# Altium schematic sheet RelayBoard.SchDoc
size A3
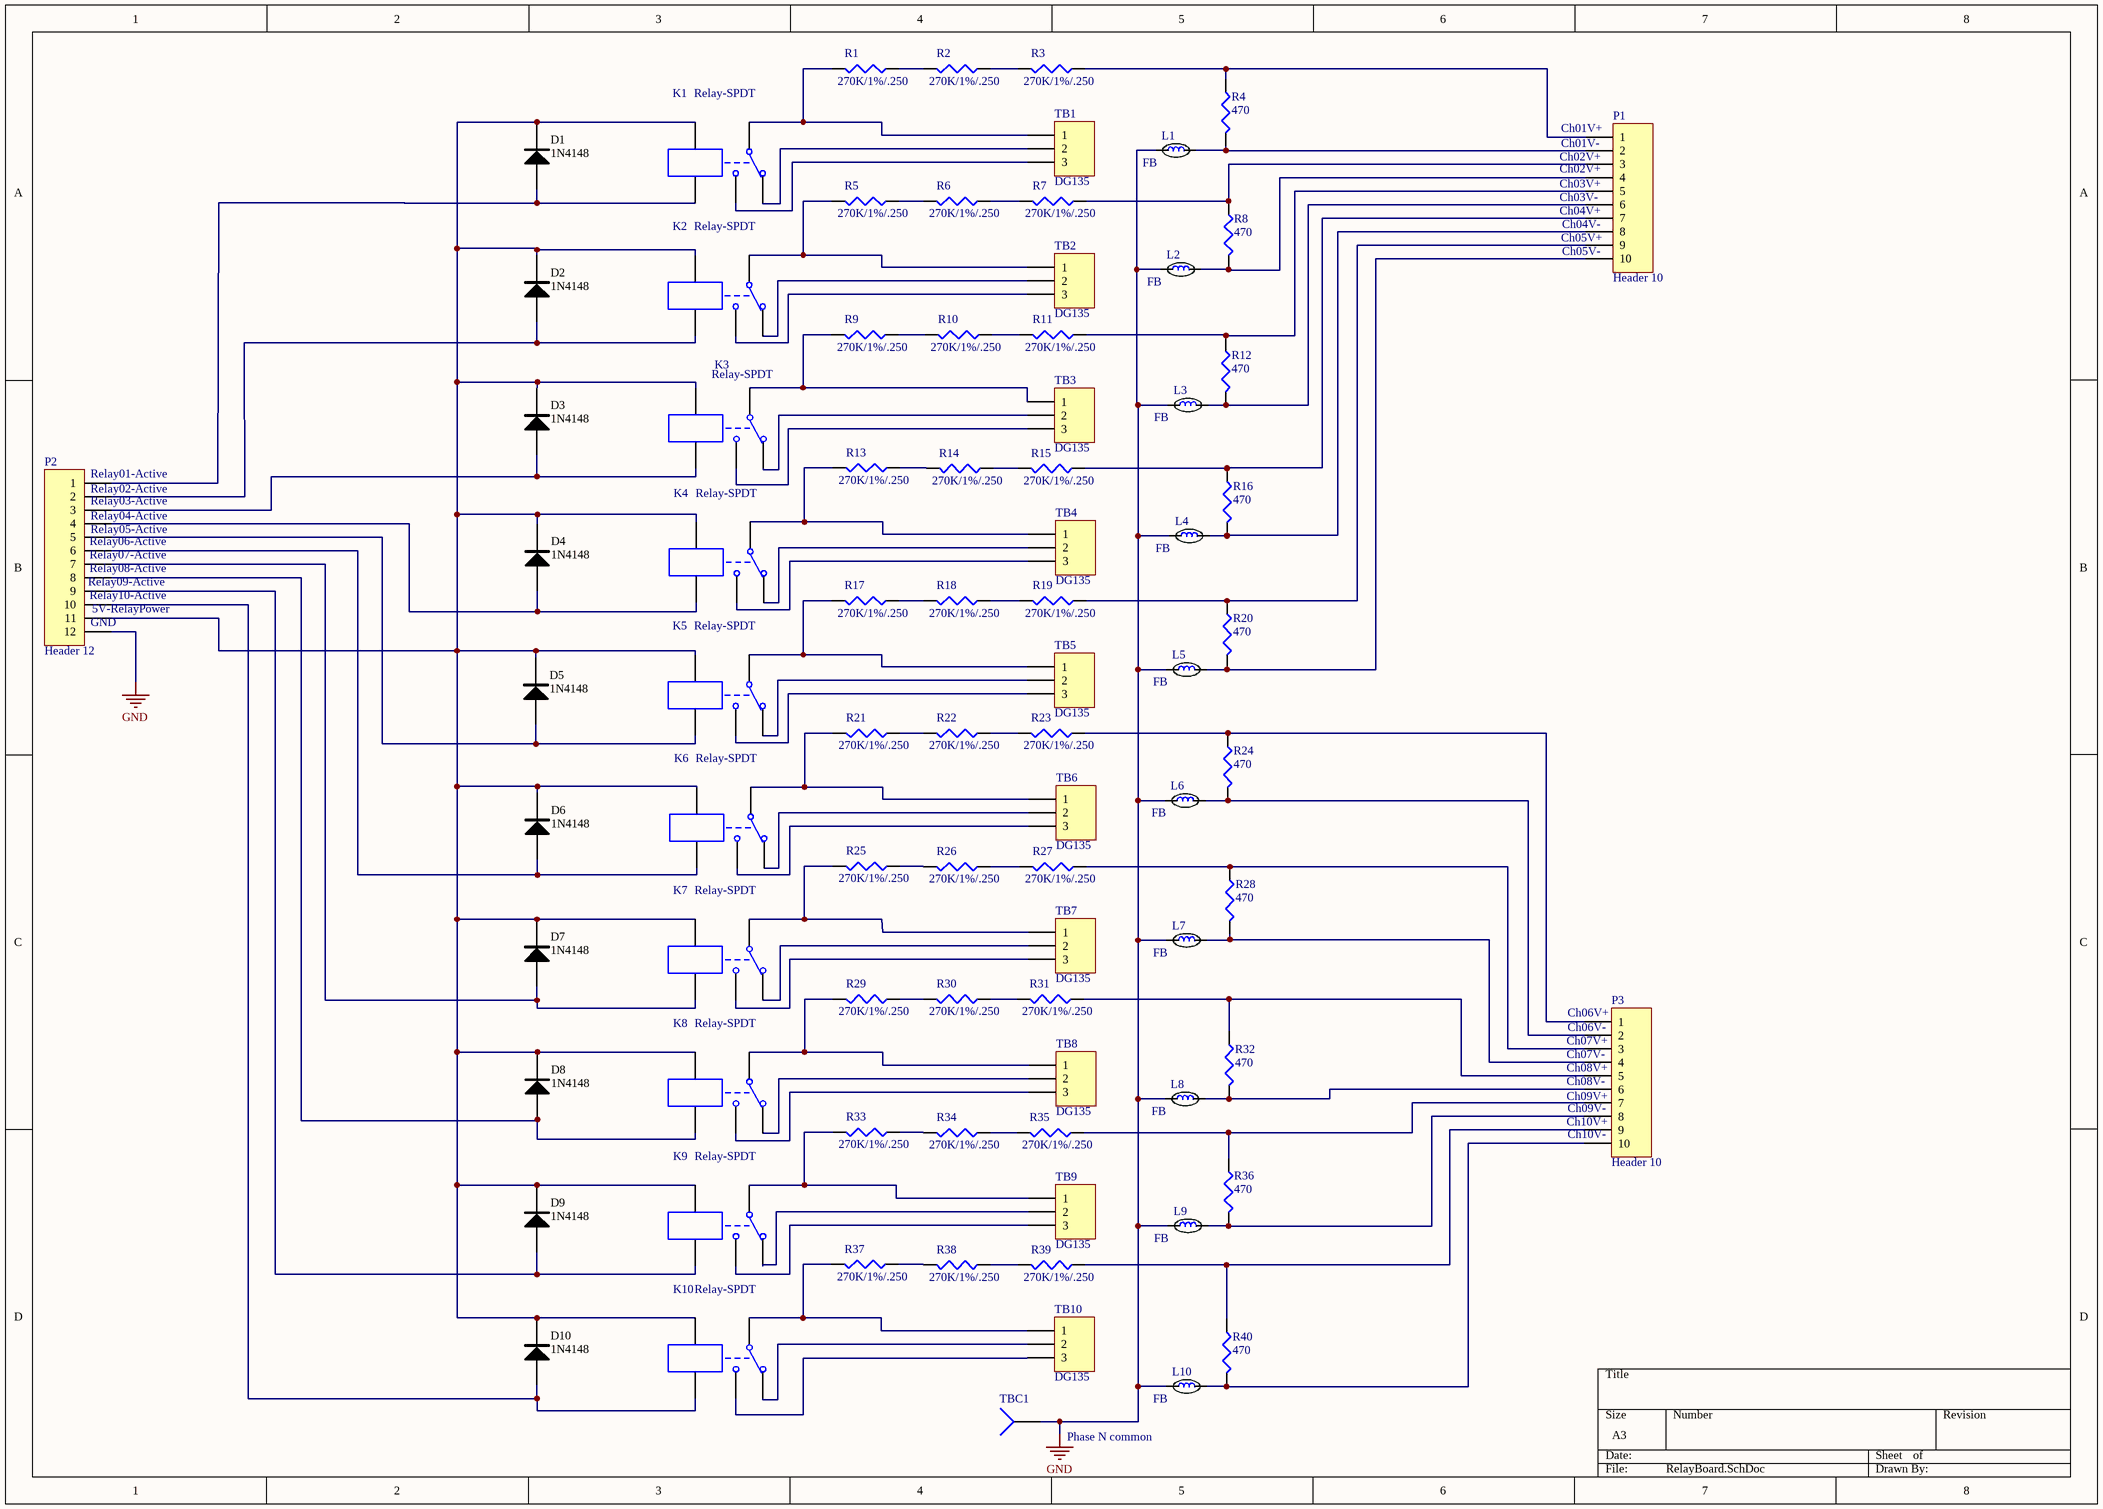
[diagram p0: RelayBoard.SchDoc]

## Parts
D1  1N4148  [SOD523]
D2  1N4148  [SOD523]
D3  1N4148  [SOD523]
D4  1N4148  [SOD523]
D5  1N4148  [SOD523]
D6  1N4148  [SOD523]
D7  1N4148  [SOD523]
D8  1N4148  [SOD523]
D9  1N4148  [SOD523]
D10  1N4148  [SOD523]
K1  Relay-SPDT  [MODULE5B]
K2  Relay-SPDT  [MODULE5B]
K3  Relay-SPDT  [MODULE5B]
K4  Relay-SPDT  [MODULE5B]
K5  Relay-SPDT  [MODULE5B]
K6  Relay-SPDT  [MODULE5B]
K7  Relay-SPDT  [MODULE5B]
K8  Relay-SPDT  [MODULE5B]
K9  Relay-SPDT  [MODULE5B]
K10  Relay-SPDT  [MODULE5B]
L1  FB  [0603C-TBD]
L2  FB  [0603C-TBD]
L3  FB  [0603C-TBD]
L4  FB  [0603C-TBD]
L5  FB  [0603C-TBD]
L6  FB  [0603C-TBD]
L7  FB  [0603C-TBD]
L8  FB  [0603C-TBD]
L9  FB  [0603C-TBD]
L10  FB  [0603C-TBD]
P1  Header 10  [HDR1X10]
P2  Header 12  [HDR1X12]
P3  Header 10  [HDR1X10]
R1  270K/1%/.250  [1210C-GENERIC]
R2  270K/1%/.250  [1210C-GENERIC]
R3  270K/1%/.250  [1210C-GENERIC]
R4  470  [1206C-GENERIC]
R5  270K/1%/.250  [1210C-GENERIC]
R6  270K/1%/.250  [1210C-GENERIC]
R7  270K/1%/.250  [1210C-GENERIC]
R8  470  [1206C-GENERIC]
R9  270K/1%/.250  [1210C-GENERIC]
R10  270K/1%/.250  [1210C-GENERIC]
R11  270K/1%/.250  [1210C-GENERIC]
R12  470  [1206C-GENERIC]
R13  270K/1%/.250  [1210C-GENERIC]
R14  270K/1%/.250  [1210C-GENERIC]
R15  270K/1%/.250  [1210C-GENERIC]
R16  470  [1206C-GENERIC]
R17  270K/1%/.250  [1210C-GENERIC]
R18  270K/1%/.250  [1210C-GENERIC]
R19  270K/1%/.250  [1210C-GENERIC]
R20  470  [1206C-GENERIC]
R21  270K/1%/.250  [1210C-GENERIC]
R22  270K/1%/.250  [1210C-GENERIC]
R23  270K/1%/.250  [1210C-GENERIC]
R24  470  [1206C-GENERIC]
R25  270K/1%/.250  [1210C-GENERIC]
R26  270K/1%/.250  [1210C-GENERIC]
R27  270K/1%/.250  [1210C-GENERIC]
R28  470  [1206C-GENERIC]
R29  270K/1%/.250  [1210C-GENERIC]
R30  270K/1%/.250  [1210C-GENERIC]
R31  270K/1%/.250  [1210C-GENERIC]
R32  470  [1206C-GENERIC]
R33  270K/1%/.250  [1210C-GENERIC]
R34  270K/1%/.250  [1210C-GENERIC]
R35  270K/1%/.250  [1210C-GENERIC]
R36  470  [1206C-GENERIC]
R37  270K/1%/.250  [1210C-GENERIC]
R38  270K/1%/.250  [1210C-GENERIC]
R39  270K/1%/.250  [1210C-GENERIC]
R40  470  [1206C-GENERIC]
TB1  DG135  [DG135-1]
TB2  DG135  [DG135-1]
TB3  DG135  [DG135-1]
TB4  DG135  [DG135-1]
TB5  DG135  [DG135-1]
TB6  DG135  [DG135-1]
TB7  DG135  [DG135-1]
TB8  DG135  [DG135-1]
TB9  DG135  [DG135-1]
TB10  DG135  [DG135-1]
TBC1  TBcommon  [PIN1]  (value not drawn)

## Nets
GND: L1.1 L2.1 L3.1 L4.1 L5.1 L6.1 L7.1 L8.1 L9.1 L10.1 P2.12 TBC1.1
NetD1_A: D1.A K1.2 P2.1
NetD1_K: D1.K D2.K D3.K D4.K D5.K D6.K D7.K D8.K D9.K D10.K K1.1 K2.1 K3.1 K4.1 K5.1 K6.1 K7.1 K8.1 K9.1 K10.1 P2.11
NetD2_A: D2.A K2.2 P2.2
NetD3_A: D3.A K3.2 P2.3
NetD4_A: D4.A K4.2 P2.4
NetD5_A: D5.A K5.2 P2.5
NetD6_A: D6.A K6.2 P2.6
NetD7_A: D7.A K7.2 P2.7
NetD8_A: D8.A K8.2 P2.8
NetD9_A: D9.A K9.2 P2.9
NetD10_A: D10.A K10.2 P2.10
NetK1_3: K1.3 TB1.3
NetK1_4: K1.4 R1.2 TB1.1
NetK1_5: K1.5 TB1.2
NetK2_3: K2.3 TB2.3
NetK2_4: K2.4 R5.2 TB2.1
NetK2_5: K2.5 TB2.2
NetK3_3: K3.3 TB3.3
NetK3_4: K3.4 R9.2 TB3.1
NetK3_5: K3.5 TB3.2
NetK4_3: K4.3 TB4.3
NetK4_4: K4.4 R13.2 TB4.1
NetK4_5: K4.5 TB4.2
NetK5_3: K5.3 TB5.3
NetK5_4: K5.4 R17.2 TB5.1
NetK5_5: K5.5 TB5.2
NetK6_3: K6.3 TB6.3
NetK6_4: K6.4 R21.2 TB6.1
NetK6_5: K6.5 TB6.2
NetK7_3: K7.3 TB7.3
NetK7_4: K7.4 R25.2 TB7.1
NetK7_5: K7.5 TB7.2
NetK8_3: K8.3 TB8.3
NetK8_4: K8.4 R29.2 TB8.1
NetK8_5: K8.5 TB8.2
NetK9_3: K9.3 TB9.3
NetK9_4: K9.4 R33.2 TB9.1
NetK9_5: K9.5 TB9.2
NetK10_3: K10.3 TB10.3
NetK10_4: K10.4 R37.2 TB10.1
NetK10_5: K10.5 TB10.2
NetL1_2: L1.2 P1.2 R4.2
NetL2_2: L2.2 P1.4
NetL3_2: L3.2 P1.6 R12.2
NetL4_2: L4.2 P1.8 R16.2
NetL5_2: L5.2 P1.10
NetL6_2: L6.2 P3.2 R24.2
NetL7_2: L7.2 P3.4 R28.2
NetL8_2: L8.2 P3.6 R32.2
NetL9_2: L9.2 P3.8 R36.2
NetL10_2: L10.2 P3.10 R40.2
NetP1_1: P1.1 R3.1 R4.1
NetP1_3: P1.3 R7.1 R8.1
NetP1_5: P1.5 R11.1 R12.1
NetP1_7: P1.7 R15.1 R16.1
NetP1_9: P1.9 R19.1 R20.1
NetP3_1: P3.1 R23.1 R24.1
NetP3_3: P3.3 R27.1 R28.1
NetP3_5: P3.5 R31.1 R32.1
NetP3_7: P3.7 R35.1 R36.1
NetP3_9: P3.9 R39.1 R40.1
NetR1_1: R1.1 R2.2
NetR2_1: R2.1 R3.2
NetR5_1: R5.1 R6.2
NetR6_1: R6.1 R7.2
NetR9_1: R9.1 R10.2
NetR10_1: R10.1 R11.2
NetR13_1: R13.1 R14.2
NetR14_1: R14.1 R15.2
NetR17_1: R17.1 R18.2
NetR18_1: R18.1 R19.2
NetR21_1: R21.1 R22.2
NetR22_1: R22.1 R23.2
NetR25_1: R25.1 R26.2
NetR26_1: R26.1 R27.2
NetR29_1: R29.1 R30.2
NetR30_1: R30.1 R31.2
NetR33_1: R33.1 R34.2
NetR34_1: R34.1 R35.2
NetR37_1: R37.1 R38.2
NetR38_1: R38.1 R39.2

Not connected (* = marked no-connect by the designer): R8 2; R20 2

## Notes on the sheet
- (near P1) Ch02V+
- (near P1) Ch01V+
- (near P1) Ch01V-
- (near P1) Ch03V+
- (near P1) Ch03V-
- (near P1) Ch04V+
- (near P1) Ch05V+
- (near P1) Ch04V-
- (near P1) Ch05V-
- (near P2) Relay03-Active
- (near P2) Relay02-Active
- (near P2) Relay01-Active
- (near P2) Relay04-Active
- (near P2) Relay09-Active
- (near P2) Relay06-Active
- (near P2) Relay07-Active
- (near P2) Relay08-Active
- (near P2) Relay05-Active
- (near P2) Relay10-Active
- (near P2) GND
- (near P2) 5V-RelayPower
- (near P3) Ch07V+
- (near P3) Ch07V-
- (near P3) Ch06V+
- (near P3) Ch06V-
- (near P3) Ch08V+
- (near P3) Ch08V-
- (near P3) Ch09V+
- (near P3) Ch10V+
- (near P3) Ch09V-
- (near P3) Ch10V-
- Phase N common

## Library data of the parts
D1-D10 = 1N4001
K1-K10 = Relay-SPDT: Single-Pole Dual-Throw Relay; Published: 24-Mar-1999; LatestRevisionDate: 17-Jul-2002; LatestRevisionNote: Re-released for DXP Platform.; PackageReference: MODULE5B; Publisher: Altium Limited
L1-L10 = FerrBeads/ILBB
P1 P3 = Header 10: Header, 10-Pin; LatestRevisionDate: 17-Jul-2002; LatestRevisionNote: Re-released for DXP Platform.; Publisher: Altium Limited
P2 = Header 12: Header, 12-Pin; LatestRevisionDate: 17-Jul-2002; LatestRevisionNote: Re-released for DXP Platform.; Publisher: Altium Limited
R1-R40 = Res3: Resistor; Published: 8-Jun-2000; LatestRevisionDate: 29-May-2009; LatestRevisionNote: IPC-7351 Footprint Added.; PackageReference: J1-0603; Publisher: Altium Limited; PackageDescription: Chip Resistor
TB1-TB10 = Header 3: Header, 3-Pin; LatestRevisionDate: 17-Jul-2002; LatestRevisionNote: Re-released for DXP Platform.; Publisher: Altium Limited
TBC1 = Socket: LatestRevisionDate: 17-Jul-2002; LatestRevisionNote: Re-released for DXP Platform.; Publisher: Altium Limited